# Altium project hub_board.PrjPcb
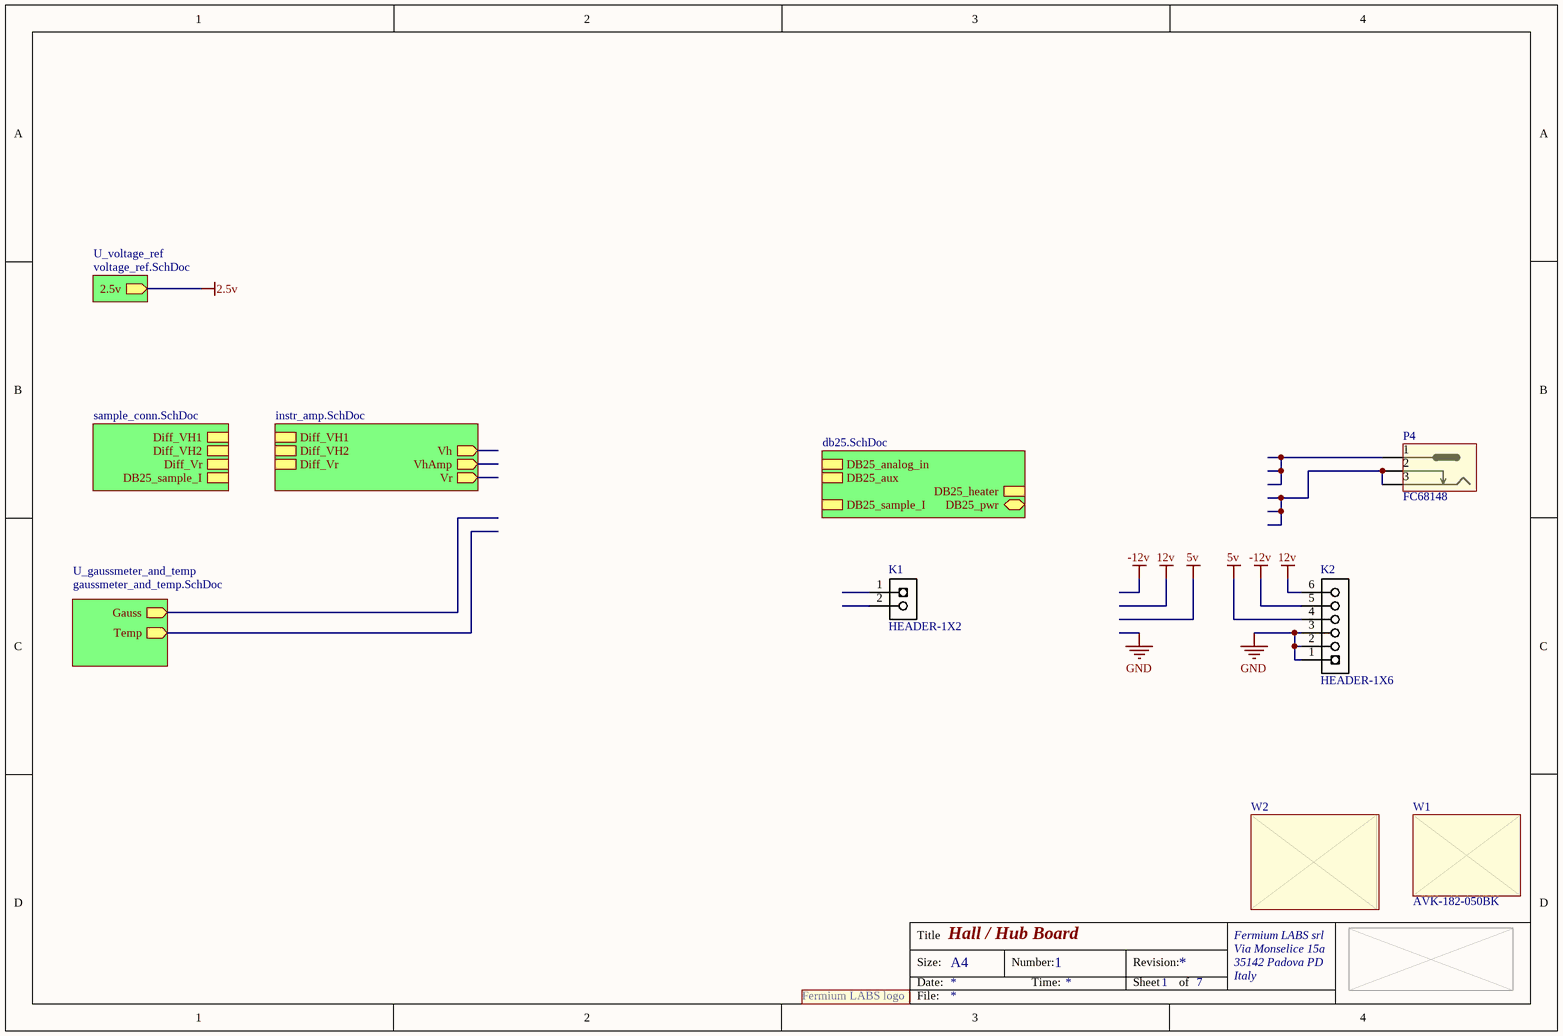
[diagram p0: hub_board.SchDoc]
6 sheets, 68 parts. Net scope: hierarchical (ports join the sheet entries above them; power ports are global).
Board file: hub_board.PcbDoc
Sheets:
  hub_board.SchDoc
    U_db25 = db25.SchDoc
    U_instr_amp = instr_amp.SchDoc
    U_sample_conn = sample_conn.SchDoc
    U_voltage_ref = voltage_ref.SchDoc
    U_gaussmeter_and_temp = gaussmeter_and_temp.SchDoc

## Sheet hub_board.SchDoc: Hall / Hub Board
size A4; DocumentNumber: 1; SheetNumber: 1; SheetTotal: 7

### Parts
K1  HEADER-1X2  [HEADER-1X2]  (no BOM)
K2  HEADER-1X6  [HEADER-1X6]  (no BOM)
logo  fermiumlabs-logo  [frm-med]  (value not drawn)  (no BOM)
P4  Supplier Part Number 1: FC68148  [dc-jack]
W1  AVK-182-050BK  (mechanical)
W2  (no value)  (mechanical)

### Sub-sheets
U_db25 = db25.SchDoc: DB25_aux (harness DB25_aux), DB25_heater (harness DB25_heater), DB25_sample_I (harness DB25_sample_I), DB25_analog_in (harness DB25_analog_in), DB25_pwr (harness DB25_pwr)
U_gaussmeter_and_temp = gaussmeter_and_temp.SchDoc: Temp (out), Gauss (out)
U_instr_amp = instr_amp.SchDoc: Vh (out), Vr (out), VhAmp (out), Diff_VH1 (harness Diff_VH1), Diff_Vr (harness Diff_Vr), Diff_VH2 (harness Diff_VH2)
U_sample_conn = sample_conn.SchDoc: Diff_Vr (harness Diff_Vr), Diff_VH1 (harness Diff_VH1), Diff_VH2 (harness Diff_VH2), DB25_sample_I (harness DB25_sample_I)
U_voltage_ref = voltage_ref.SchDoc: 2.5v (out)

### Nets
5v: K2.4
12v: K2.6  [project net GAUSS-I_P]
-12v: K2.5
GND: K2.1 K2.2 K2.3
NetP4_2: P4.2 P4.3

Not connected (* = marked no-connect by the designer): K1 1 2; P4 1

### Notes on the sheet
- Title
- Size:
- Date:
- A4
- Number:
- Time:
- Revision:
- Sheet
- of
- Fermium LABS srl
- Via Monselice 15a
- 35142 Padova PD
- Italy
- File:
- (in symbol fermiumlabs-logo) Fermium LABS logo

### Library data of the parts
P4 = jackdc: Manufacturer: CLIFF; Manufacturer Part Number: DC-10A FC68148; Pads: 3 THT; Supplier 1: TME
W1 = AVK-182-050BK: Manufacturer Part Number: 63824; Manufacturer: GOOBAY; Supplier 1: TME; Supplier Part Number 1: AVK-182-050BK
W2 = CAB-25WW/2: Manufacturer: BQ CABLE; Supplier 1: TME; Manufacturer Part Number: CAB-25WW/2; Supplier part Number 1: CAB-25WW/2

## Sheet db25.SchDoc: Hall / Hub Board / DB25
size A4; DocumentNumber: 3; SheetNumber: 3; SheetTotal: 7
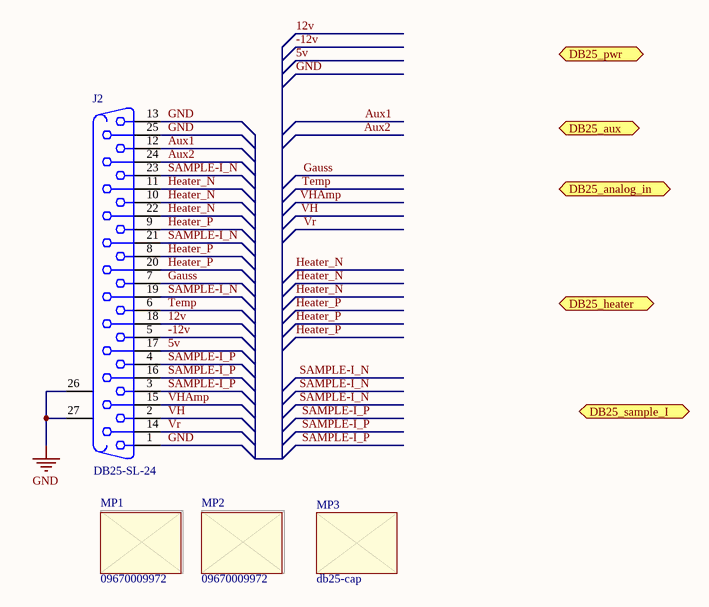
[diagram p1: db25.SchDoc]

### Parts
J2  Manufacturer Part Number: DB25-SL-24  [DB25]
MP1  09670009972  (mechanical)
MP2  09670009972  (mechanical)
MP3  db25-cap  (mechanical)

### Ports
DB25_analog_in (harness DB25_analog_in), DB25_aux (harness DB25_aux), DB25_heater (harness DB25_heater), DB25_pwr (harness DB25_pwr), DB25_sample_I (harness DB25_sample_I)

### Nets
GND: J2.1 J2.13 J2.25 J2.26(MH1) J2.27(MH2)
5v: J2.17
12v: J2.18
-12v: J2.5
Aux1: J2.12
Aux2: J2.24
Gauss: J2.7
Heater_N: J2.10 J2.11 J2.22
Heater_P: J2.8 J2.9 J2.20
SAMPLE-I_N: J2.19 J2.21 J2.23
SAMPLE-I_P: J2.3 J2.4 J2.16
Temp: J2.6
VH: J2.2
VHAmp: J2.15
Vr: J2.14

### Notes on the sheet
- Title
- Size:
- Date:
- A4
- Number:
- Time:
- Revision:
- Sheet
- of
- Fermium LABS srl
- Via Monselice 15a
- 35142 Padova PD
- Italy
- File:

### Library data of the parts
J2 = D Connector 25: d-sub, 25 pins,  Right Angle; Manufacturer: ADAM TECH; Pads: 29 THT; Supplier 1: TME; Supplier Part Number 1: DB25-SL-24; Category: D-Sub connectors
MP1 MP2 = 09670009972: Manufacturer: HARTING; Supplier 1: TME; Supplier Part Number 1: 09670009972; Manufacturer Part Number: 09670009972
MP3 = db25-cap: Manufacturer Part Number: 2105-0100-03; Manufacturer: Encitech; Supplier 1: TME; Supplier Part Number 1: DC25-P

## Sheet instr_amp.SchDoc: Hall / Hub Board / Diff. Amp.
size A4; DocumentNumber: 5; SheetNumber: 5; SheetTotal: 7
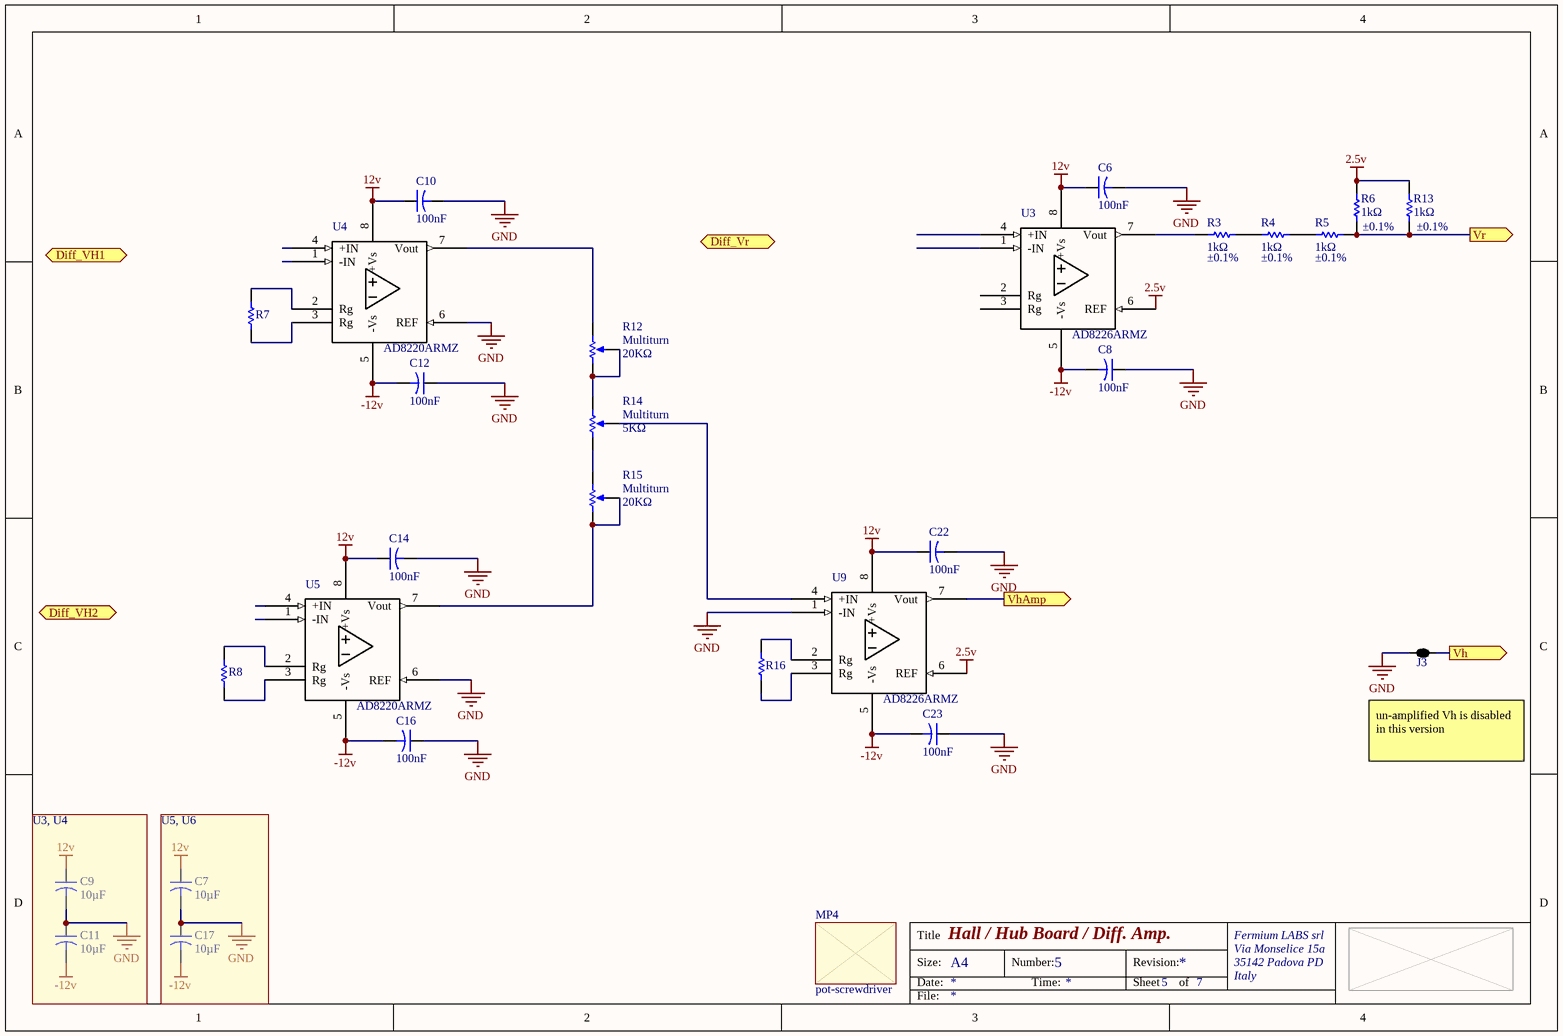
[diagram p2: instr_amp.SchDoc]

### Parts
C6  Capacitance: 100nF  [CAP 0805/2012]
C7  Capacitance: 10µF  [CAP 1206/3216]
C8  Capacitance: 100nF  [CAP 0805/2012]
C9  Capacitance: 10µF  [CAP 1206/3216]
C10  Capacitance: 100nF  [CAP 0805/2012]
C11  Capacitance: 10µF  [CAP 1206/3216]
C12  Capacitance: 100nF  [CAP 0805/2012]
C14  Capacitance: 100nF  [CAP 0805/2012]
C16  Capacitance: 100nF  [CAP 0805/2012]
C17  Capacitance: 10µF  [CAP 1206/3216]
C22  Capacitance: 100nF  [CAP 0805/2012]
C23  Capacitance: 100nF  [CAP 0805/2012]
J3  2 way net tie junction  [2way_LP]  (value not drawn)  (net tie, no BOM)
MP4  pot-screwdriver  (mechanical)
R3  Resistance: 1kΩ  Tolerance: ±0.1%  [RES 0805/2012]
R4  Resistance: 1kΩ  Tolerance: ±0.1%  [RES 0805/2012]
R5  Resistance: 1kΩ  Tolerance: ±0.1%  [RES 0805/2012]
R6  Resistance: 1kΩ  Tolerance: ±0.1%  [RES 0805/2012]
R7  (no value)  [RES 0805/2012]  (no BOM)
R8  (no value)  [RES 0805/2012]  (no BOM)
R12  Multiturn  Resistance: 20KΩ  [trimmer-multiturn]
R13  Resistance: 1kΩ  Tolerance: ±0.1%  [RES 0805/2012]
R14  Multiturn  Resistance: 5KΩ  [trimmer-multiturn]
R15  Multiturn  Resistance: 20KΩ  [trimmer-multiturn]
R16  (no value)  [RES 0805/2012]  (no BOM)
U3  Manufacturer Part Number: AD8226ARMZ  [MSOP_MO-187-AA AD8220]
U4  Supplier Part Number 1: AD8220ARMZ  [MSOP_MO-187-AA AD8220]
U5  Supplier Part Number 1: AD8220ARMZ  [MSOP_MO-187-AA AD8220]
U9  Manufacturer Part Number: AD8226ARMZ  [MSOP_MO-187-AA AD8220]

### Blocks framed on the sheet
U3, U4: C9 C11
U5, U6: C7 C17

### Ports
Diff_VH1 (harness Diff_VH1), Diff_VH2 (harness Diff_VH2), Diff_Vr (harness Diff_Vr), Vh (out), VhAmp (out), Vr (out)

### Nets
2.5v: R6.2 R13.2 U3.6(REF) U9.6(REF)
12v: C6.1 C7.1 C9.1 C10.1 C14.1 C22.1 U3.8(+Vs) U4.8(+Vs) U5.8(+Vs) U9.8(+Vs)  [project net GAUSS-I_P]
-12v: C8.2 C11.2 C12.2 C16.2 C17.2 C23.2 U3.5(-Vs) U4.5(-Vs) U5.5(-Vs) U9.5(-Vs)
GND: C6.2 C7.2 C8.1 C9.2 C10.2 C11.1 C12.1 C14.2 C16.1 C17.1 C22.2 C23.1 J3.1 U4.6(REF) U5.6(REF) U9.1(-IN)
NetJ3_2: J3.2 ; port Vh
NetR3_1: R3.1 R4.2
NetR3_2: R3.2 U3.7(Vout)
NetR4_1: R4.1 R5.2
NetR5_1: R5.1 R6.1 R13.1 ; port Vr
NetR7_1: R7.1 U4.2(Rg)
NetR7_2: R7.2 U4.3(Rg)
NetR8_1: R8.1 U5.2(Rg)
NetR8_2: R8.2 U5.3(Rg)
NetR12_1: R12.1 R12.3 R14.2
NetR12_2: R12.2 U4.7(Vout)
NetR14_1: R14.1 R15.2
NetR14_3: R14.3 U9.4(+IN)
NetR15_1: R15.1 R15.3 U5.7(Vout)
NetR16_1: R16.1 U9.2(Rg)
NetR16_2: R16.2 U9.3(Rg)
NetU9_7: U9.7(Vout) ; port VhAmp

Not connected (* = marked no-connect by the designer): U3 1(-IN) 2(Rg) 3(Rg) 4(+IN); U4 1(-IN) 4(+IN); U5 1(-IN) 4(+IN)

### Notes on the sheet
- (near J3) un-amplified Vh is disabled in this version
- Title
- Size:
- Date:
- A4
- Number:
- Time:
- Revision:
- Sheet
- of
- Fermium LABS srl
- Via Monselice 15a
- 35142 Padova PD
- Italy
- File:

### Library data of the parts
C6 C8 C10 C12 C14 C16 C22 C23 = Cap2: Capacitor; Manufacturer: YAGEO; Manufacturer Part Number: CC0805JRX7R9BB104; Unit: pcs; SuppliedAmount: 0; MinAmount: 100; Capacitor type: ceramic; Capacitor kind: MLCC; Operating voltage: 50V; Dielectric: X7R; Tolerance: ±5%; Case - inch: 0805; Case - mm: 2012; Pads: 2 SMD; Supplier 1: TME; Supplier Part Number 1: CC0805JRX7R9104; Category: 0805 MLCC SMD Capacitors; Stock 1: 89911; Pricing 1: 100=0.00613, 300=0.00464, 1000=0.00342, 4000=0.00284, 20000=0.00273 (EUR); Weight: 0.042; Multiples: 100; Mounting: SMD; Price Type: NET; ComponentLink1URL: http://static.tme.eu/products_pics/d/b/b/dbbd93eaf25225110ca26eb66da77328/58538.jpg; ComponentLink1Description: http://static.tme.eu/products_pics/d/b/b/dbbd93eaf25225110ca26eb66da77328/58538.jpg
C7 C9 C11 C17 = Cap2: Capacitor; Manufacturer: SAMSUNG; Manufacturer Part Number: CL31A106KAHNNNE; Unit: pcs; SuppliedAmount: 0; MinAmount: 100; Capacitor type: ceramic; Capacitor kind: MLCC; Operating voltage: 25V; Dielectric: X5R; Tolerance: ±10%; Case - inch: 1206; Case - mm: 3216; Pads: 2 SMD; Published: 23-Sep-2002; PackageReference: CAPR5-4X5; Publisher: Altium Limited; PackageDescription: 1206; Supplier 1: TME; Supplier Part Number 1: CL31A106KAHNNNE; Category: 1206 MLCC SMD Capacitors; Stock 1: 279700; Pricing 1: 100=0.0248, 300=0.0203, 1000=0.0167, 2000=0.0131, 10000=0.0127 (EUR); Weight: 0.061; Multiples: 100; Mounting: SMD; Operating temperature: -55...85°C; Price Type: NET; ComponentLink1URL: http://static.tme.eu/products_pics/b/e/9/be9e0dd298dcf4979ea1dd3d226e0bfa/58780.jpg; ComponentLink1Description: http://static.tme.eu/products_pics/b/e/9/be9e0dd298dcf4979ea1dd3d226e0bfa/58780.jpg
J3 = 2way: ComponentLink1URL: http://www.edatools.cz/addons; ComponentLink1Description: Source; FootprintNote: LP=12mil, MP=40mil, HP=120mil
MP4 = pot-screwdriver: Manufacturer Part Number: H-90; Manufacturer: BOURNS; Supplier 1: TME; Supplier Part Number 1: H-90
R3-R6 R13 = Res1: Resistor; Manufacturer: VIKING; Manufacturer Part Number: AR05BTCW1001; Manufacturer series: AR; Unit: pcs; SuppliedAmount: 0; MinAmount: 10; Kind of resistor: precise; Case - inch: 0805; Case - mm: 2012; Power: 0.125W; Max. operating voltage: 150V; Max. overload voltage: 300V; Temperature coefficient: 25ppm/°C; Pads: 2 SMD; Published: 8-Jun-2000; LatestRevisionDate: 17-Jul-2002; LatestRevisionNote: Re-released for DXP Platform.; PackageReference: AXIAL-0.3; Publisher: Altium Limited; PackageDescription: Axial Device, Thru-Hole; 2 Leads; 0.3 in Pin Spacing; Supplier 1: TME; Supplier Part Number 1: AR0805-1K-0.1%; Category: 0805 SMD Precision Resistors; Stock 1: 0; Pricing 1: 10=0.11211, 100=0.05707, 1000=0.03771, 5000=0.03176 (EUR); Weight: 0.034; Multiples: 10; Resistor type: thin film; Mounting: SMD; Operating temperature: -55...155°C; Price Type: NET; ComponentLink1URL: http://static.tme.eu/products_pics/6/6/c/66cc5cd64257edd80ca8e9fd2040972d/56038.jpg; ComponentLink1Description: http://static.tme.eu/products_pics/6/6/c/66cc5cd64257edd80ca8e9fd2040972d/56038.jpg; Supplier 2: TME; Supplier Part Number 2: AR0805-1K13-0.1%; Stock 2: 750; Pricing 2: 10=0.11119, 100=0.05661, 1000=0.0374, 5000=0.0315 (EUR)
R7 R8 R16 = Res1: Resistor; Pads: N/A
R12 R15 = RPot: Potentiometer; Manufacturer: SR PASSIVES; Manufacturer Part Number: T910X-20K; Pads: 3 THT; Supplier 1: TME; Supplier Part Number 1: T910X-20K
R14 = RPot: Potentiometer; Manufacturer: SR PASSIVES; Manufacturer Part Number: T910X-5K; Pads: 3 THT; Supplier 1: TME; Supplier Part Number 1: T910X-5K
U3 U9 = AD8226: Instrumentation amplifier; Manufacturer: Analog Devices; Supply Type: Single, Dual; Number of Channels: 1 Channel; 3 dB Bandwidth: 1.5 MHz; CMRR - Common Mode Rejection Ratio: 120 dB; Dual Supply Voltage: 1.35 V to 18 V; Gain V/V: 1 V/V to 1000 V/V; Ib - Input Bias Current: 35 nA; Maximum Input Resistance: 800 MOhms at +/- 15 V; Operating Supply Current: 325 uA; Operating Supply Voltage: 2.2 V to 36 V; SR - Slew Rate: 0.4 V/us; Supply Voltage - Max: 36 V; Supply Voltage - Min: 2.2 V; Voltage Gain dB: 60 dB; Vos - Input Offset Voltage: 100 uV; Pads: 8 SMD; Supplier 1: Mouser; Supplier Part Number 1: 584-AD8226ARMZ; RoHS: RoHS Compliant; Category: Instrumentation Amplifiers; Stock 1: 679; Pricing 1: 1=2.48, 10=2.22, 25=1.99, 50=1.87, 100=1.82, 250=1.64, 500=1.47, 1000=1.28 (EUR); Amplifier Type: Instrumentation Amplifier; Height: 0.85 mm; Length: 3 mm; Package / Case: MSOP-8; Packaging: Tube; Product: Instrumentation Amplifiers; Series: AD8226; Width: 3 mm; Brand: Analog Devices; Mounting Style: SMD/SMT; GBP - Gain Bandwidth Product: -; Maximum Operating Temperature: + 125 C; Minimum Operating Temperature: - 40 C; Standard Pack Qty: 50; Vcm - Common Mode Voltage: 2.2 V to 36 V; RoHS - Mouser: Y; Minimum Order Quantity: 1; Reeling: False; ComponentLink1URL: http://www.mouser.com/ds/2/609/AD8226-877720.pdf; ComponentLink1Description: http://www.mouser.com/ds/2/609/AD8226-877720.pdf
U4 U5 = AD8226: Instrumentation amplifier; Manufacturer: ANALOG DEVICES; Unit: pcs; SuppliedAmount: 0; MinAmount: 1; Integrated circuit type: operational amplifier; Transmission band frequency: 1.5MHz; Supply voltage: 4.5...36V DC; Slew rate: 2V/μs; Pads: 8 SMD; Supplier 1: TME; Manufacturer Part Number: AD8220ARMZ; Category: SMD Operational Amplifiers; Stock 1: 47; Pricing 1: 1=5.19, 3=4.91, 10=4.16, 25=3.87 (EUR); Weight: 3.79; Multiples: 1; Mounting: SMD; Number of channels: 1; Case: MSOP8; Operating temperature: -40...85°C; Price Type: NET; ComponentLink1URL: http://static.tme.eu/products_pics/5/3/1/531d7915b61678c8109674b14bfbf850/285547.jpg; ComponentLink1Description: http://static.tme.eu/products_pics/5/3/1/531d7915b61678c8109674b14bfbf850/285547.jpg

## Sheet sample_conn.SchDoc: Hall / Hub Board / Sample Conn.
size A4; DocumentNumber: 6; SheetNumber: 6; SheetTotal: 7
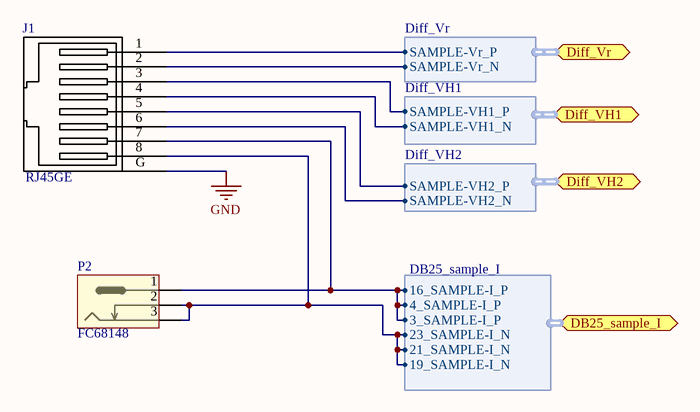
[diagram p3: sample_conn.SchDoc]

### Parts
J1  (no value)  [RJ45GE]
P2  Supplier Part Number 1: FC68148  [dc-jack]  (no BOM)

### Ports
DB25_sample_I (harness DB25_sample_I), Diff_VH1 (harness Diff_VH1), Diff_VH2 (harness Diff_VH2), Diff_Vr (harness Diff_Vr)

### Harnesses
Diff_Vr: SAMPLE-Vr_N, SAMPLE-Vr_P
Diff_VH1: SAMPLE-VH1_N, SAMPLE-VH1_P
DB25_sample_I: 16_SAMPLE-I_P, 19_SAMPLE-I_N, 21_SAMPLE-I_N, 23_SAMPLE-I_N, 3_SAMPLE-I_P, 4_SAMPLE-I_P
Diff_VH2: SAMPLE-VH2_N, SAMPLE-VH2_P

### Nets
GND: J1.G(GND)
NetJ1_1: J1.1 ; port Diff_Vr.SAMPLE-Vr_P
NetJ1_2: J1.2 ; port Diff_Vr.SAMPLE-Vr_N
NetJ1_3: J1.3 ; port Diff_VH1.SAMPLE-VH1_P
NetJ1_4: J1.4 ; port Diff_VH1.SAMPLE-VH1_N
NetJ1_5: J1.5 ; port Diff_VH2.SAMPLE-VH2_P
NetJ1_6: J1.6 ; port Diff_VH2.SAMPLE-VH2_N
NetJ1_7: J1.7 P2.1 ; port DB25_sample_I.16_SAMPLE-I_P, port DB25_sample_I.3_SAMPLE-I_P, port DB25_sample_I.4_SAMPLE-I_P
NetJ1_8: J1.8 P2.2 P2.3 ; port DB25_sample_I.19_SAMPLE-I_N, port DB25_sample_I.21_SAMPLE-I_N, port DB25_sample_I.23_SAMPLE-I_N

### Notes on the sheet
- Title
- Size:
- Date:
- A4
- Number:
- Time:
- Revision:
- Sheet
- of
- Fermium LABS srl
- Via Monselice 15a
- 35142 Padova PD
- Italy
- File:

### Library data of the parts
J1 = RJ45-GENERIC: Connector  RJ45 8 PIN; Manufacturer: NINIGI; Unit: pcs; SuppliedAmount: 0; MinAmount: 1; Connector: socket; Connector variant: shielded; Type of pin configuration: 8p8c; Electrical mounting: THT; Spatial orientation: angled 90°; Pads: 10 THT; Supplier 1: TME; Supplier Part Number 1: RJ45GE; Manufacturer Part Number: RJ45GE; Category: RJ connectors; Stock 1: 27637; Pricing 1: 1=0.609, 10=0.4872, 50=0.3897, 200=0.3045, 1000=0.2741 (EUR); Weight: 4.4; Multiples: 1; Connector type: RJ45; Number of pins: 8; Price Type: NET; ComponentLink1URL: http://static.tme.eu/products_pics/0/e/e/0ee711a9a85500572fe5689c7f237f48/338553.jpg; ComponentLink1Description: http://static.tme.eu/products_pics/0/e/e/0ee711a9a85500572fe5689c7f237f48/338553.jpg
P2 = jackdc: Manufacturer: CLIFF; Manufacturer Part Number: DC-10A FC68148; Unit: pcs; SuppliedAmount: 0; MinAmount: 1; Connector: socket; Connector type: DC supply; Contact size: 5,5/2,1mm; Plug outside diameter: 5.5mm; Plug inside diameter: 2.1mm; Connector variant: with on/off switch; Electrical mounting: soldering; Rated current: 5A; Rated voltage: 12V DC; Spatial orientation: angled 90°; Pads: 3 THT; Supplier 1: TME; Category: DC power connectors; Stock 1: 20287; Pricing 1: 1=0.4194, 20=0.3065, 100=0.2581, 500=0.2258 (USD); Weight: 1.733; Multiples: 1; Package type: in bulk; Price Type: NET; ComponentLink1URL: http://static.tme.eu/products_pics/f/8/e/f8eb2e1bea4ffe6692f5958f8ef9edd4/323250.jpg; ComponentLink1Description: http://static.tme.eu/products_pics/f/8/e/f8eb2e1bea4ffe6692f5958f8ef9edd4/323250.jpg

## Sheet voltage_ref.SchDoc: Hall / Hub Board / Voltage ref.
size A4; DocumentNumber: 7; SheetNumber: 7; SheetTotal: 7
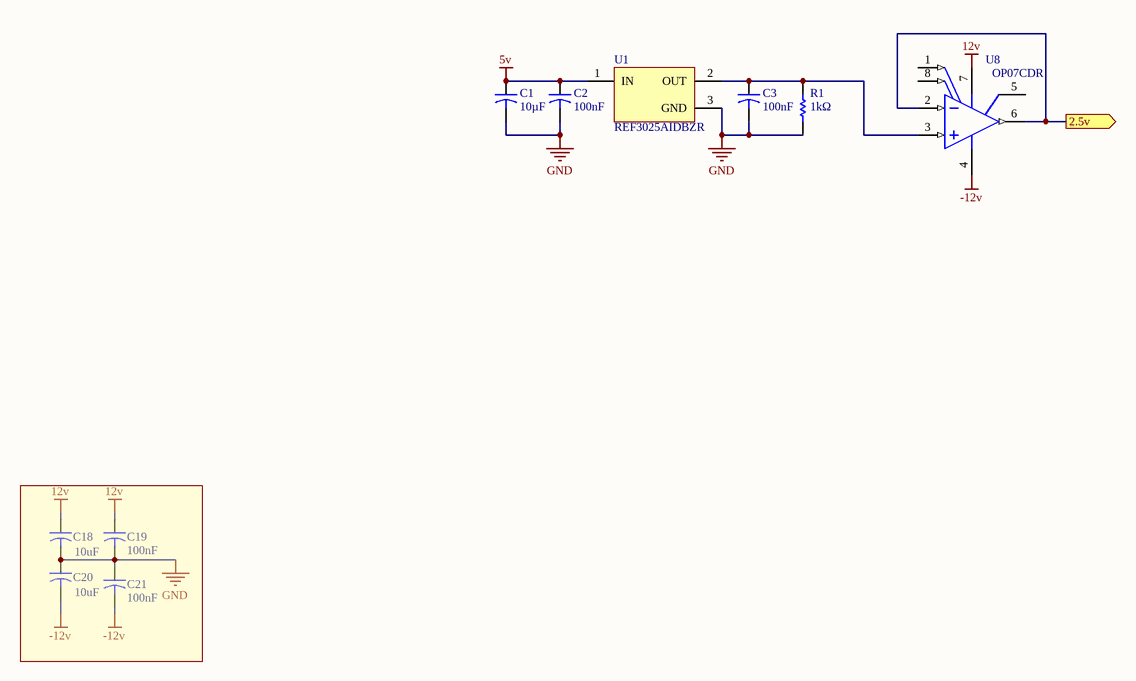
[diagram p4: voltage_ref.SchDoc]

### Parts
C1  Capacitance: 10µF  [CAP 1206/3216]
C2  Capacitance: 100nF  [CAP 0805/2012]
C3  Capacitance: 100nF  [CAP 0805/2012]
C18  value 10uF  [CAP 1206/3216]  (hidden comment: Cap2)
C19  Capacitance: 100nF  [CAP 0805/2012]
C20  value 10uF  [CAP 1206/3216]  (hidden comment: Cap2)
C21  Capacitance: 100nF  [CAP 0805/2012]
R1  Resistance: 1kΩ  [RES 0805/2012]
U1  (no value)  [TI-DBZ3_N]
U8  (no value)  [TI-D8_N]

### Ports
2.5v (out)

### Nets
2.5v: U8.2(IN-) U8.6(OUT) ; port 2.5v
5v: C1.1 C2.1 U1.1(IN)
12v: C18.1 C19.1 U8.7(VCC+)  [project net GAUSS-I_P]
-12v: C20.2 C21.2 U8.4(VCC-)
GND: C1.2 C2.2 C3.2 C18.2 C19.2 C20.1 C21.1 R1.2 U1.3(GND)
NetC3_1: C3.1 R1.1 U1.2(OUT) U8.3(IN+)

Not connected (* = marked no-connect by the designer): U8 1(OFFSET_N1) 5(NC) 8(OFFSET_N2)

### Notes on the sheet
- Title
- Size:
- Date:
- A4
- Number:
- Time:
- Revision:
- Sheet
- of
- Fermium LABS srl
- Via Monselice 15a
- 35142 Padova PD
- Italy
- File:

### Library data of the parts
C1 = Cap2: as C7 on sheet instr_amp; Published: 23-Sep-2002; PackageReference: CAPR5-4X5; Publisher: Altium Limited; PackageDescription: 1206; Supplier 1: TME; Supplier Part Number 1: CL31A106KAHNNNE; Category: 1206 MLCC SMD Capacitors; Stock 1: 279700; Pricing 1: 100=0.0248, 300=0.0203, 1000=0.0167, 2000=0.0131, 10000=0.0127 (EUR); Weight: 0.061; Multiples: 100; Mounting: SMD; Operating temperature: -55...85°C; Price Type: NET; ComponentLink1URL: http://static.tme.eu/products_pics/b/e/9/be9e0dd298dcf4979ea1dd3d226e0bfa/58780.jpg; ComponentLink1Description: http://static.tme.eu/products_pics/b/e/9/be9e0dd298dcf4979ea1dd3d226e0bfa/58780.jpg
C2 = Cap2: Capacitor; Manufacturer: YAGEO; Manufacturer Part Number: CC0805JRX7R9BB104; Unit: pcs; SuppliedAmount: 0; MinAmount: 100; Capacitor type: ceramic; Capacitor kind: MLCC; Operating voltage: 50V; Dielectric: X7R; Tolerance: ±5%; Case - inch: 0805; Case - mm: 2012; Supplier 1: TME; Supplier Part Number 1: CC0805JRX7R9104; Category: 0805 MLCC SMD Capacitors; Stock 1: 89911; Pricing 1: 100=0.00613, 300=0.00464, 1000=0.00342, 4000=0.00284, 20000=0.00273 (EUR); Weight: 0.042; Multiples: 100; Mounting: SMD; Price Type: NET; ComponentLink1URL: http://static.tme.eu/products_pics/d/b/b/dbbd93eaf25225110ca26eb66da77328/58538.jpg; ComponentLink1Description: http://static.tme.eu/products_pics/d/b/b/dbbd93eaf25225110ca26eb66da77328/58538.jpg; Pads: *
C3 C19 C21 = Cap2: as C6 on sheet instr_amp; Supplier 1: TME; Supplier Part Number 1: CC0805JRX7R9104; Category: 0805 MLCC SMD Capacitors; Stock 1: 89911; Pricing 1: 100=0.00613, 300=0.00464, 1000=0.00342, 4000=0.00284, 20000=0.00273 (EUR); Weight: 0.042; Multiples: 100; Mounting: SMD; Price Type: NET; ComponentLink1URL: http://static.tme.eu/products_pics/d/b/b/dbbd93eaf25225110ca26eb66da77328/58538.jpg; ComponentLink1Description: http://static.tme.eu/products_pics/d/b/b/dbbd93eaf25225110ca26eb66da77328/58538.jpg
C18 C20 = Cap2: Capacitor; Manufacturer: SAMSUNG; Manufacturer Part Number: CL31A106KAHNNNE; Unit: pcs; SuppliedAmount: 0; MinAmount: 100; Capacitor type: ceramic; Capacitor kind: MLCC; Capacitance: 10µF; Operating voltage: 25V; Dielectric: X5R; Tolerance: ±10%; Case - inch: 1206; Case - mm: 3216; Pads: 2 SMD; Published: 23-Sep-2002; PackageReference: CAPR5-4X5; Publisher: Altium Limited; PackageDescription: 1206; Supplier 1: TME; Supplier Part Number 1: CL31A106KAHNNNE; Category: 1206 MLCC SMD Capacitors; Stock 1: 279700; Pricing 1: 100=0.0248, 300=0.0203, 1000=0.0167, 2000=0.0131, 10000=0.0127 (EUR); Weight: 0.061; Multiples: 100; Mounting: SMD; Operating temperature: -55...85°C; Price Type: NET; ComponentLink1URL: http://static.tme.eu/products_pics/b/e/9/be9e0dd298dcf4979ea1dd3d226e0bfa/58780.jpg; ComponentLink1Description: http://static.tme.eu/products_pics/b/e/9/be9e0dd298dcf4979ea1dd3d226e0bfa/58780.jpg
R1 = Res1: Resistor; Manufacturer: VIKING; Manufacturer Part Number: AR05BTCW1001; Manufacturer series: AR; Unit: pcs; SuppliedAmount: 0; MinAmount: 10; Kind of resistor: precise; Case - inch: 0805; Case - mm: 2012; Power: 0.125W; Tolerance: ±0.1%; Max. operating voltage: 150V; Max. overload voltage: 300V; Temperature coefficient: 25ppm/°C; Pads: 2 SMD; Published: 8-Jun-2000; LatestRevisionDate: 17-Jul-2002; LatestRevisionNote: Re-released for DXP Platform.; PackageReference: AXIAL-0.3; Publisher: Altium Limited; PackageDescription: Axial Device, Thru-Hole; 2 Leads; 0.3 in Pin Spacing; Supplier 1: TME; Supplier Part Number 1: AR0805-1K-0.1%; Category: 0805 SMD Precision Resistors; Stock 1: 0; Pricing 1: 10=0.11211, 100=0.05707, 1000=0.03771, 5000=0.03176 (EUR); Weight: 0.034; Multiples: 10; Resistor type: thin film; Mounting: SMD; Operating temperature: -55...155°C; Price Type: NET; ComponentLink1URL: http://static.tme.eu/products_pics/6/6/c/66cc5cd64257edd80ca8e9fd2040972d/56038.jpg; ComponentLink1Description: http://static.tme.eu/products_pics/6/6/c/66cc5cd64257edd80ca8e9fd2040972d/56038.jpg; Supplier 2: TME; Supplier Part Number 2: AR0805-1K13-0.1%; Stock 2: 750; Pricing 2: 10=0.11119, 100=0.05661, 1000=0.0374, 5000=0.0315 (EUR)
U1 = REF3025AIDBZR: Voltage reference, 2.5V; Manufacturer: Texas Instruments; Accuracy: 100 uV/mA; Temperature Coefficient: 50 PPM / C; Reference Type: Series References; Series VREF - Input Voltage - Max: 5.5 V; Shunt Current - Max: 25 mA; Supply Current - Max: 50 uA; Initial Accuracy: 0.2 %; Operating Supply Current: 42 uA; Pads: 3 SMD; Supplier 1: Mouser; Supplier Part Number 1: 595-REF3025AIDBZR; Manufacturer Part Number: REF3025AIDBZR; RoHS: RoHS Compliant; Category: Voltage References; Stock 1: 2808; Pricing 1: 1=1.29, 10=1.15, 25=1.06, 50=0.950, 100=0.900, 250=0.841, 500=0.743, 1000=0.508, 3000=0.508 (EUR); Height: 1 mm; Length: 2.92 mm; Operating Temperature Range: - 40 C to + 125 C; Output Voltage: 2.5 V; Package / Case: SOT-23-3; Packaging: Reel; Product: Voltage References; Series: REF3025; Width: 1.3 mm; Brand: Texas Instruments; Mounting Style: SMD/SMT; Topology: Series References; Maximum Operating Temperature: + 125 C; Minimum Operating Temperature: - 40 C; Standard Pack Qty: 3000; RoHS - Mouser: Y; Minimum Order Quantity: 1; Reeling: True
U8 = OP07CDR: Low-Offset Voltage Operational Amplifier, 6 to 36 V, 0 to 70 degC, 8-pin SOIC (D8), Green (RoHS & no Sb/Br); Manufacturer: TEXAS INSTRUMENTS; Unit: pcs; SuppliedAmount: 0; MinAmount: 3; Multiples: 1; Transmission band frequency: 600kHz; Supply voltage: 3...18V DC; Slew rate: 0.3V/μs; Pads: 8 SMD; Supplier 1: TME; Supplier Part Number 1: OP07CDR; Manufacturer Part Number: OP07CDR; Category: SMD Operational Amplifiers; Stock 1: 2258; Pricing 1: 3=0.2668, 10=0.2451, 50=0.2177, 250=0.1848, 1000=0.165 (EUR); Weight: 0.23; Integrated circuit type: operational amplifier; Mounting: SMD; Number of channels: 1; Case: SO8; Price Type: NET; ComponentLink1URL: http://static.tme.eu/products_pics/4/8/a/48a33ccfb5a851d5982dcdda0776f7ac/285338.jpg; ComponentLink1Description: http://static.tme.eu/products_pics/4/8/a/48a33ccfb5a851d5982dcdda0776f7ac/285338.jpg

## Sheet gaussmeter_and_temp.SchDoc: Hall / Hub Board / Gaussm. + Temp
size A4; DocumentNumber: 4; SheetNumber: 4; SheetTotal: 7
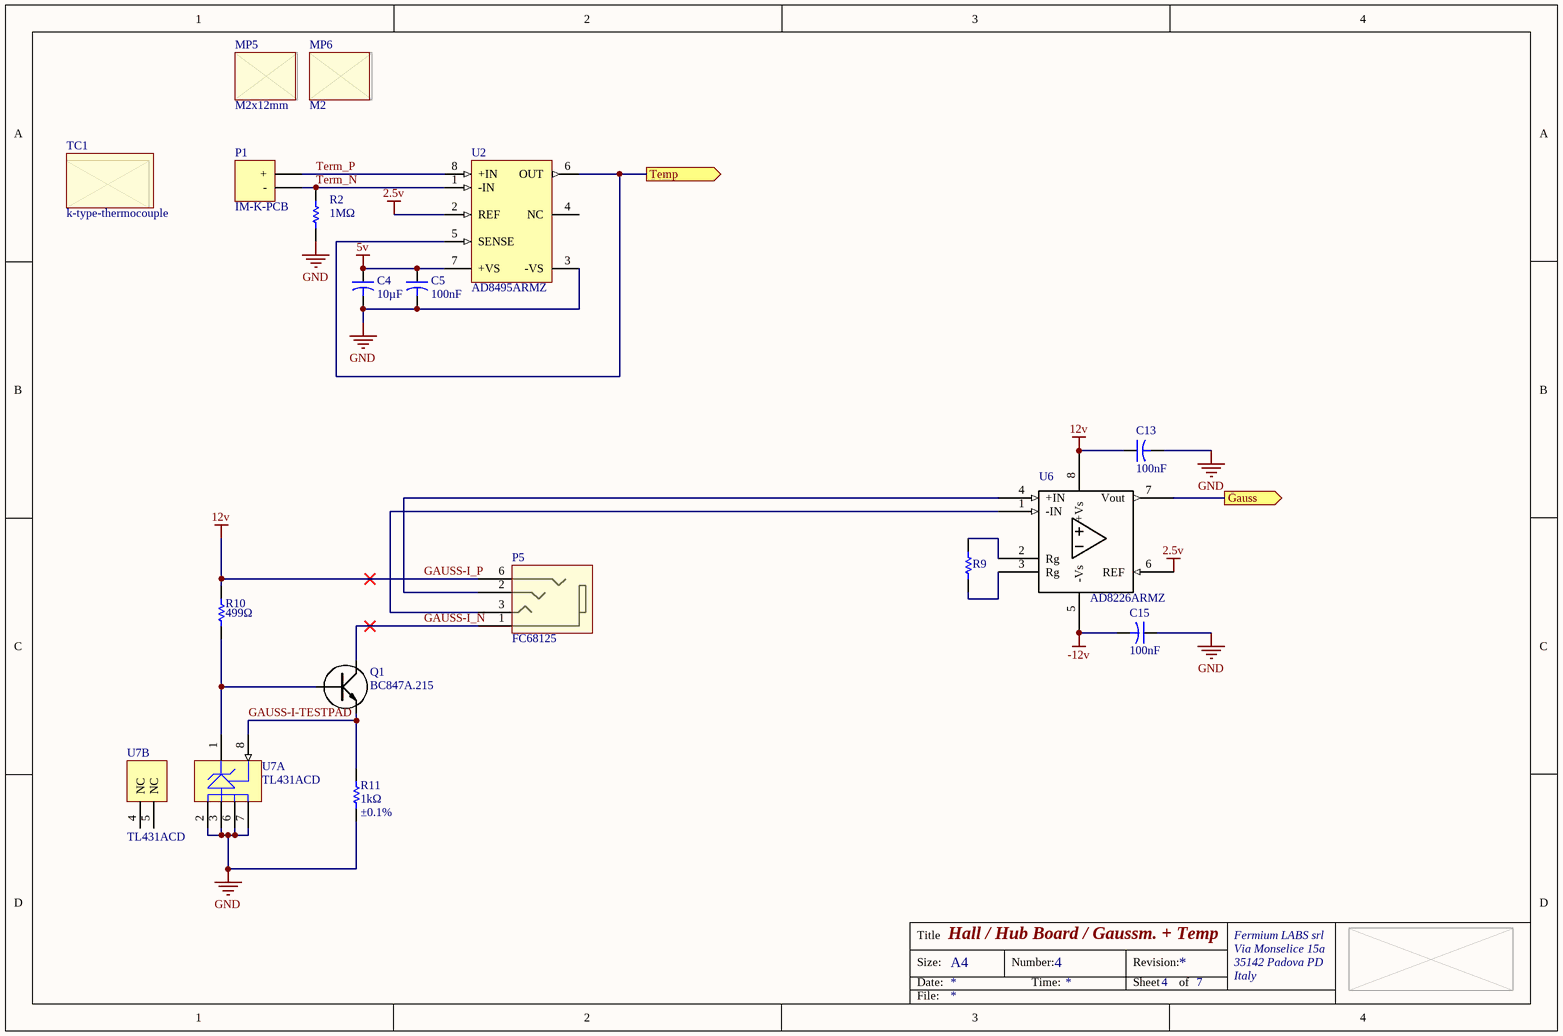
[diagram p5: gaussmeter_and_temp.SchDoc]

### Parts
C4  Capacitance: 10µF  [CAP 1206/3216]
C5  Capacitance: 100nF  [CAP 0805/2012]
C13  Capacitance: 100nF  [CAP 0805/2012]
C15  Capacitance: 100nF  [CAP 0805/2012]
MP5  Size: M2x12mm  (hidden comment: screw-M2x12mm)  (mechanical)
MP6  Size: M2  (hidden comment: nut-M2)  (mechanical)
P1  (no value)  [IM-K-PCB]
P5  (no value)  [FC68125]
Q1  Supplier Part Number 1: BC847A.215  [SOT23-BCE]
R2  Resistance: 1MΩ  [RES 0805/2012]
R9  (no value)  [RES 0805/2012]  (no BOM)
R10  Resistance: 499Ω  [RES 0805/2012]
R11  Resistance: 1kΩ  Tolerance: ±0.1%  [RES 0805/2012]
TC1  k-type-thermocouple  (mechanical)
U2  Manufacturer Part Number: AD8495ARMZ  [ADI-RM-8_N]
U6  Manufacturer Part Number: AD8226ARMZ  [MSOP_MO-187-AA AD8220]
U7  (no value)  [TI-D8_N]  (parts A,B of 2)

### Ports
Gauss (out), Temp (out)

### Nets
2.5v: U2.2(REF) U6.6(REF)
5v: C4.1 C5.1 U2.7(+VS)
-12v: C15.2 U6.5(-Vs)
GAUSS-I_P: C13.1 P5.6 R10.1 U6.8(+Vs)  [also labelled 12v]
GND: C4.2 C5.2 C13.2 C15.1 R2.2 R11.2 U2.3(-VS) U7.2(ANODE) U7.3(ANAODE) U7.6(ANODE) U7.7(ANODE)
GAUSS-I-TESTPAD: Q1.E R11.1 U7.8(REF)
GAUSS-I_N: P5.1 Q1.C
Term_N: P1.- R2.1 U2.1(-IN)
Term_P: P1.+ U2.8(+IN)
NetP5_2: P5.2 U6.4(+IN)
NetP5_3: P5.3 U6.1(-IN)
NetQ1_B: Q1.B R10.2 U7.1(CATHODE)
NetR9_1: R9.1 U6.2(Rg)
NetR9_2: R9.2 U6.3(Rg)
NetU2_5: U2.5(SENSE) U2.6(OUT) ; port Temp
NetU6_7: U6.7(Vout) ; port Gauss

Not connected (* = marked no-connect by the designer): U2 4(NC); U7 4(NC) 5(NC)

### Notes on the sheet
- Title
- Size:
- Date:
- A4
- Number:
- Time:
- Revision:
- Sheet
- of
- Fermium LABS srl
- Via Monselice 15a
- 35142 Padova PD
- Italy
- File:

### Library data of the parts
C4 = Cap2: as C7 on sheet instr_amp; Published: 23-Sep-2002; PackageReference: CAPR5-4X5; Publisher: Altium Limited; PackageDescription: 1206; Supplier 1: TME; Supplier Part Number 1: CL31A106KAHNNNE; Category: 1206 MLCC SMD Capacitors; Stock 1: 279700; Pricing 1: 100=0.0248, 300=0.0203, 1000=0.0167, 2000=0.0131, 10000=0.0127 (EUR); Weight: 0.061; Multiples: 100; Mounting: SMD; Operating temperature: -55...85°C; Price Type: NET; ComponentLink1URL: http://static.tme.eu/products_pics/b/e/9/be9e0dd298dcf4979ea1dd3d226e0bfa/58780.jpg; ComponentLink1Description: http://static.tme.eu/products_pics/b/e/9/be9e0dd298dcf4979ea1dd3d226e0bfa/58780.jpg
C5 C13 C15 = Cap2: as C6 on sheet instr_amp; Supplier 1: TME; Supplier Part Number 1: CC0805JRX7R9104; Category: 0805 MLCC SMD Capacitors; Stock 1: 89911; Pricing 1: 100=0.00613, 300=0.00464, 1000=0.00342, 4000=0.00284, 20000=0.00273 (EUR); Weight: 0.042; Multiples: 100; Mounting: SMD; Price Type: NET; ComponentLink1URL: http://static.tme.eu/products_pics/d/b/b/dbbd93eaf25225110ca26eb66da77328/58538.jpg; ComponentLink1Description: http://static.tme.eu/products_pics/d/b/b/dbbd93eaf25225110ca26eb66da77328/58538.jpg
MP5 = screw-M2x12mm: Manufacturer Part Number: M2X12/D965; Manufacturer: KRAFTBERG; Supplier 1: TME; Supplier Part Number 1: M2X12/D965
MP6 = nut-M2: Manufacturer Part Number: M2/D934-A2; Manufacturer: KRAFTBERG; Supplier 1: TME; Supplier Part Number 1: M2/D934-A2
P1 = Header 2: K thermocouple connector; Manufacturer: LABFACILITY; Pads: 2 THT; Supplier 1: Farnell; Supplier Part Number 1: 3810628; Manufacturer Part Number: IM-K-PCB
P5 = FC68125: Manufacturer: CLIFF; Unit: pcs; SuppliedAmount: 0; MinAmount: 2; Multiples: 1; Connector: socket; Connector type: Jack 3,5mm; Number of ways: 4; Electrical mounting: THT; Pads: 5 THT; Supplier 1: TME; Supplier Part Number 1: FC68125; Manufacturer Part Number: FC68125; Category: Jack connectors; Stock 1: 1312; Pricing 1: 2=0.41, 20=0.37, 100=0.33, 500=0.28 (USD); Weight: 0.942; Width: 7.1mm; Height: 6mm; Depth: 15.1mm; Price Type: NET; ComponentLink1URL: http://static.tme.eu/products_pics/9/3/a/93a060f269bb569398921100f84c519a/360179.jpg; ComponentLink1Description: http://static.tme.eu/products_pics/9/3/a/93a060f269bb569398921100f84c519a/360179.jpg
Q1 = BC847: NPN TRANSISTOR; Manufacturer: NXP; Unit: pcs; SuppliedAmount: 0; MinAmount: 25; Multiples: 1; Polarisation: bipolar; Collector-emitter voltage: 50V; Collector current: 100mA; Pads: 3 SMD; Supplier 1: TME; Manufacturer Part Number: BC847A.215; Category: NPN SMD Transistors; Stock 1: 12409; Pricing 1: 25=0.0184, 100=0.0119, 500=0.0101, 3000=0.00834, 12000=0.00776 (EUR); Weight: 0.036; Transistor type: NPN; Case: SOT23; Mounting: SMD; Quantity in package: 3000pcs.; Package type: reel; Price Type: NET; ComponentLink1URL: http://static.tme.eu/products_pics/b/2/d/b2d52d61b89775d5a69a2709edebf449/322489.jpg; ComponentLink1Description: http://static.tme.eu/products_pics/b/2/d/b2d52d61b89775d5a69a2709edebf449/322489.jpg
R2 = Res1: Resistor; Manufacturer: ROYAL OHM; Manufacturer Part Number: 0805S8J0105T5E; Unit: pcs; SuppliedAmount: 0; MinAmount: 100; Case - inch: 0805; Case - mm: 2012; Power: 0.125W; Tolerance: ±5%; Max. operating voltage: 150V; Max. overload voltage: 300V; Temperature coefficient: 100ppm/°C; Pads: 2 SMD; Published: 8-Jun-2000; LatestRevisionDate: 17-Jul-2002; LatestRevisionNote: Re-released for DXP Platform.; PackageReference: AXIAL-0.3; Publisher: Altium Limited; PackageDescription: Axial Device, Thru-Hole; 2 Leads; 0.3 in Pin Spacing; Supplier 1: TME; Supplier Part Number 1: SMD0805-1M; Category: 0805 SMD Resistors; Stock 1: 9400; Pricing 1: 100=0.00616, 1000=0.00237, 5000=0.00081, 15000=0.00077, 50000=0.00074 (EUR); Weight: 0.031; Multiples: 100; Resistor type: thick film; Mounting: SMD; Operating temperature: -55...125°C; Price Type: NET; ComponentLink1URL: http://static.tme.eu/products_pics/a/3/4/a34f7a182e69d69fdfdb65c44b99ca64/60560.jpg; ComponentLink1Description: http://static.tme.eu/products_pics/a/3/4/a34f7a182e69d69fdfdb65c44b99ca64/60560.jpg
R9 = Res1: Resistor; Pads: N/A
R10 = Res1: Resistor; Manufacturer: ROYAL OHM; Manufacturer Part Number: TC0525B4990T1E; Unit: pcs; SuppliedAmount: 0; MinAmount: 10; Kind of resistor: precise; Case - inch: 0805; Case - mm: 2012; Power: 100mW; Tolerance: ±0.1%; Max. operating voltage: 100V; Max. overload voltage: 200V; Temperature coefficient: 25ppm/°C; Pads: 2 SMD; Supplier 1: TME; Supplier Part Number 1: TC0525B4990T1E; Category: 0805 SMD Precision Resistors; Stock 1: 1880; Pricing 1: 10=0.11377, 50=0.08438, 250=0.06352, 1000=0.05404 (EUR); Weight: 0.079; Multiples: 10; Resistor type: thin film; Mounting: SMD; Price Type: NET; ComponentLink1URL: http://static.tme.eu/products_pics/9/f/6/9f65441075116f8118ec43255d000045/56542.jpg; ComponentLink1Description: http://static.tme.eu/products_pics/9/f/6/9f65441075116f8118ec43255d000045/56542.jpg
R11 = Res1: as R3 on sheet instr_amp; Published: 8-Jun-2000; LatestRevisionDate: 17-Jul-2002; LatestRevisionNote: Re-released for DXP Platform.; PackageReference: AXIAL-0.3; Publisher: Altium Limited; PackageDescription: Axial Device, Thru-Hole; 2 Leads; 0.3 in Pin Spacing; Supplier 1: TME; Supplier Part Number 1: AR0805-1K-0.1%; Category: 0805 SMD Precision Resistors; Stock 1: 0; Pricing 1: 10=0.11211, 100=0.05707, 1000=0.03771, 5000=0.03176 (EUR); Weight: 0.034; Multiples: 10; Resistor type: thin film; Mounting: SMD; Operating temperature: -55...155°C; Price Type: NET; ComponentLink1URL: http://static.tme.eu/products_pics/6/6/c/66cc5cd64257edd80ca8e9fd2040972d/56038.jpg; ComponentLink1Description: http://static.tme.eu/products_pics/6/6/c/66cc5cd64257edd80ca8e9fd2040972d/56038.jpg; Supplier 2: TME; Supplier Part Number 2: AR0805-1K13-0.1%; Stock 2: 750; Pricing 2: 10=0.11119, 100=0.05661, 1000=0.0374, 5000=0.0315 (EUR)
TC1 = k-type-thermocouple: Manufacturer Part Number: TP01; Supplier 1: Aliexpress; Supplier Part Number 1: TP01; Manufacturer: N/A
U2 = AD8494ARMZ: K thermocouple amplifier; Manufacturer: Analog Devices; Output Type: Analog; Interface Type: 2-wire; Operating Supply Current: 180 uA; Supply Voltage - Max: 18 V; Supply Voltage - Min: 2.7 V; Pads: 8 SMD; Supplier 1: Mouser; Supplier Part Number 1: 584-AD8495ARMZ; RoHS: RoHS Compliant; Category: Sensor Interface; Stock 1: 2392; Pricing 1: 1=4.35, 10=3.88, 25=3.49, 50=3.28, 100=3.19, 250=2.88, 500=2.56, 1000=2.25 (EUR); Package / Case: MSOP-8; Packaging: Tube; Series: AD8495; Type: Thermocouple Amplifier; Brand: Analog Devices; Mounting Style: SMD/SMT; Maximum Operating Temperature: + 125 C; Minimum Operating Temperature: - 40 C; Standard Pack Qty: 50; RoHS - Mouser: Y; Minimum Order Quantity: 1; Reeling: False; ComponentLink1URL: http://www.mouser.com/ds/2/609/AD8494_8495_8496_8497-877834.pdf; ComponentLink1Description: http://www.mouser.com/ds/2/609/AD8494_8495_8496_8497-877834.pdf
U6 = AD8226: as U3 on sheet instr_amp; Supplier 1: Mouser; Supplier Part Number 1: 584-AD8226ARMZ; RoHS: RoHS Compliant; Category: Instrumentation Amplifiers; Stock 1: 679; Pricing 1: 1=2.48, 10=2.22, 25=1.99, 50=1.87, 100=1.82, 250=1.64, 500=1.47, 1000=1.28 (EUR); Amplifier Type: Instrumentation Amplifier; Height: 0.85 mm; Length: 3 mm; Package / Case: MSOP-8; Packaging: Tube; Product: Instrumentation Amplifiers; Series: AD8226; Width: 3 mm; Brand: Analog Devices; Mounting Style: SMD/SMT; GBP - Gain Bandwidth Product: -; Maximum Operating Temperature: + 125 C; Minimum Operating Temperature: - 40 C; Standard Pack Qty: 50; Vcm - Common Mode Voltage: 2.2 V to 36 V; RoHS - Mouser: Y; Minimum Order Quantity: 1; Reeling: False; ComponentLink1URL: http://www.mouser.com/ds/2/609/AD8226-877720.pdf; ComponentLink1Description: http://www.mouser.com/ds/2/609/AD8226-877720.pdf
U7 = TL431ACD: Adjustable Precision Shunt Regulator; Manufacturer: TEXAS INSTRUMENTS; Unit: pcs; SuppliedAmount: 0; MinAmount: 10; Multiples: 1; Integrated circuit type: voltage reference source; Output voltage: 2.5...36V; Pads: 6 SMD; Supplier 1: TME; Supplier Part Number 1: TL431ACD; Manufacturer Part Number: TL431ACD; Category: Reference Voltage Sources - Circuits; Stock 1: 3090; Pricing 1: 10=0.0783, 50=0.0746, 250=0.0654, 1000=0.0565, 5000=0.0517 (EUR); Weight: 0.174; Mounting: SMD; Case: SO8; Price Type: NET; ComponentLink1URL: http://static.tme.eu/products_pics/f/b/8/fb840e32b578dec2f5f44f6e02ebb846/218579.jpg; ComponentLink1Description: http://static.tme.eu/products_pics/f/b/8/fb840e32b578dec2f5f44f6e02ebb846/218579.jpg

## Nets that join several sheets
2.5v: instr_amp (R6.2 R13.2 U3.6 U9.6), voltage_ref (U8.2 U8.6), gaussmeter_and_temp (U2.2 U6.6)
5v: hub_board (K2.4), voltage_ref (C1.1 C2.1 U1.1), gaussmeter_and_temp (C4.1 C5.1 U2.7)
-12v: hub_board (K2.5), instr_amp (10 pins), voltage_ref (C20.2 C21.2 U8.4), gaussmeter_and_temp (C15.2 U6.5)
GAUSS-I_P: hub_board (K2.6), instr_amp (10 pins), voltage_ref (C18.1 C19.1 U8.7), gaussmeter_and_temp (C13.1 P5.6 R10.1 U6.8)
GND: hub_board (K2.1 K2.2 K2.3), db25 (5 pins), instr_amp (16 pins), sample_conn (J1.G), voltage_ref (9 pins), gaussmeter_and_temp (11 pins)

## Assembly variants
Hall: not fitted P2